# Altium schematic sheet Power.SchDoc
size A4; Organization: Altium Limited; Address1: L3, 12a Rodborough Rd; Address2: Frenchs Forest; Address3: NSW; Address4: Australia 2086
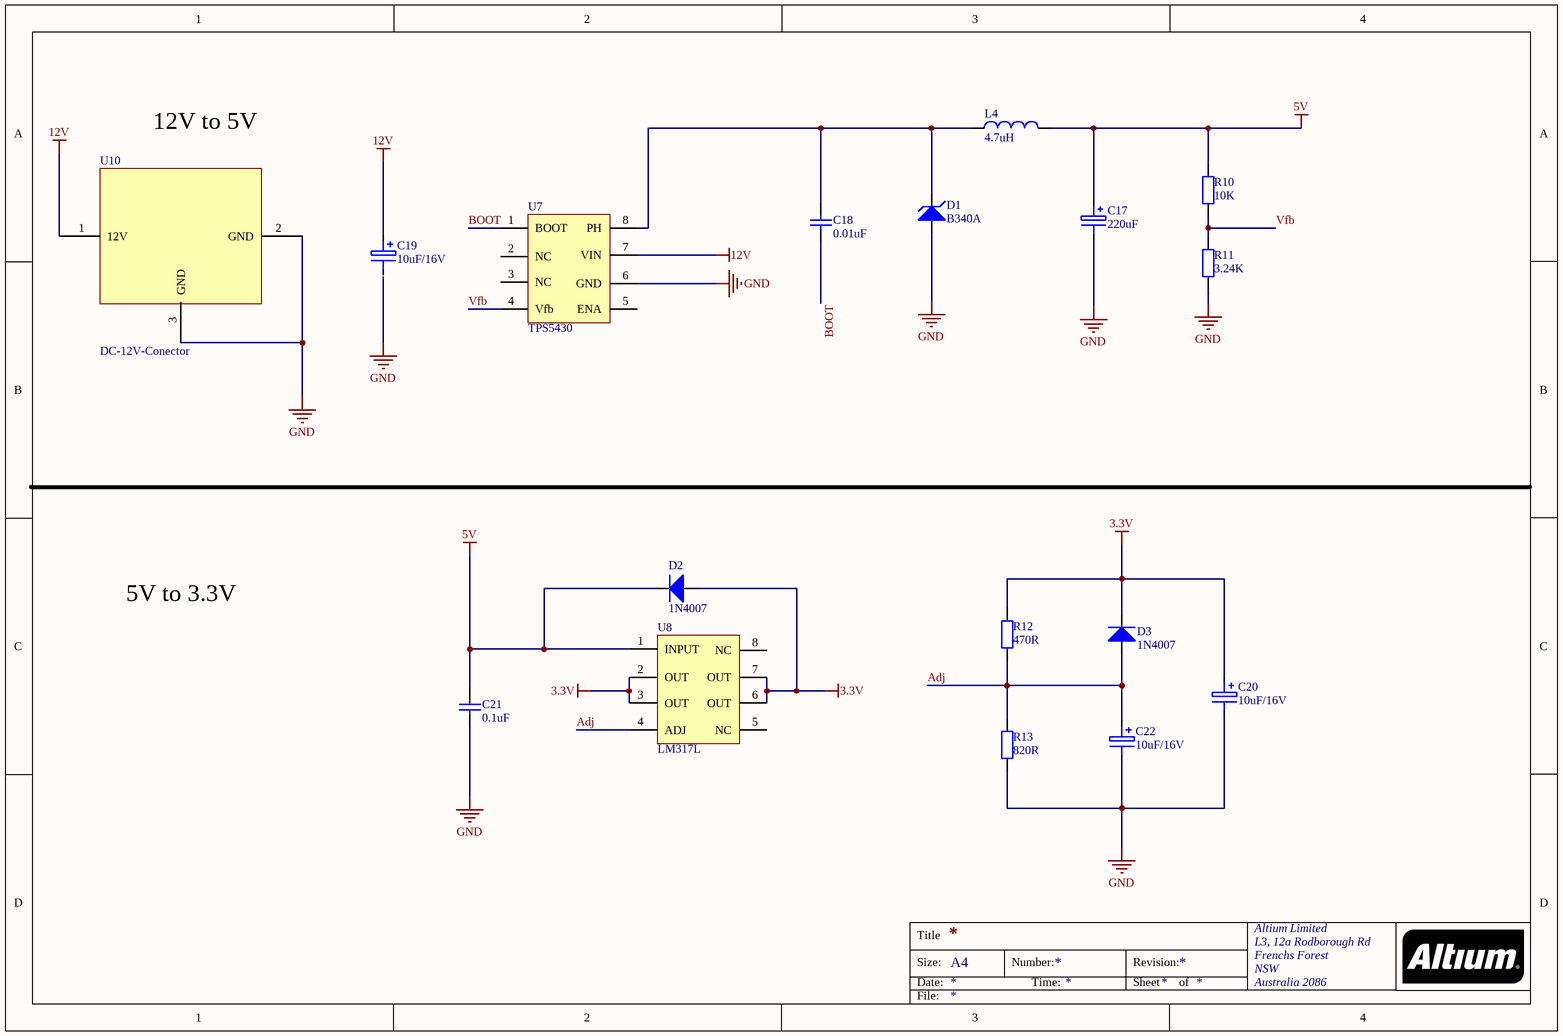
[diagram p0: Power.SchDoc]

## Parts
C17  220uF  [CAPM-7.0*4.5]
C18  0.01uF  [0603]
C19  10uF/16V  [CAPM-7.0*4.5]
C20  10uF/16V  [CAPM-5.5*3.3]
C21  0.1uF  [0603]
C22  10uF/16V  [CAPM-5.5*3.3]
D1  B340A  [DO214-AC]
D2  1N4007  [DO214-AC]
D3  1N4007  [DO214-AC]
L4  4.7uH  [7*7*4-15uH]
R10  10K  [0603]
R11  3.24K  [0603]
R12  470R  [0603]
R13  820R  [0603]
U7  TPS5430  [TPS5430]
U8  LM317L  [LM317L]
U10  DC-12V-Conector  [DC-12V-Con]

## Nets
3.3V: C20.1 D2.1(A) D3.2(K) R12.2 U8.2(OUT) U8.3(OUT) U8.6(OUT) U8.7(OUT)
5V: C17.1 C21.2 D2.2(K) L4.2 R10.2 U8.1(INPUT)
12V: C19.1 U7.7(VIN) U10.1(12V)
GND: C17.2 C20.2 C21.1 C22.2 D1.1(A) R11.1 R13.1 U7.6(GND) U10.2(GND) U10.3(GND)
Adj: C22.1 D3.1(A) R12.1 R13.2 U8.4(ADJ)
BOOT: C18.1 U7.1(BOOT)
Vfb: R10.1 R11.2 U7.4(Vfb)
NetC18_2: C18.2 D1.2(K) L4.1 U7.8(PH)

Not connected (* = marked no-connect by the designer): C19 2; U7 2(NC) 3(NC) 5(ENA); U8 5(NC) 8(NC)

## Notes on the sheet
- 12V to 5V
- 5V to 3.3V
- Title
- Size:
- Date:
- A4
- Number:
- Time:
- Revision:
- Sheet
- of
- File:

## Library data of the parts
C17 C19 C20 C22 = Cap3: aluminum
C18 C21 = Cap1: ceramic
D1 = B340A-13-F
L4 = Inductor
R10-R13 = Res
U10 = DC12V-Connector